# EAGLE design usbtin_clone (EAGLE 6.5.0)
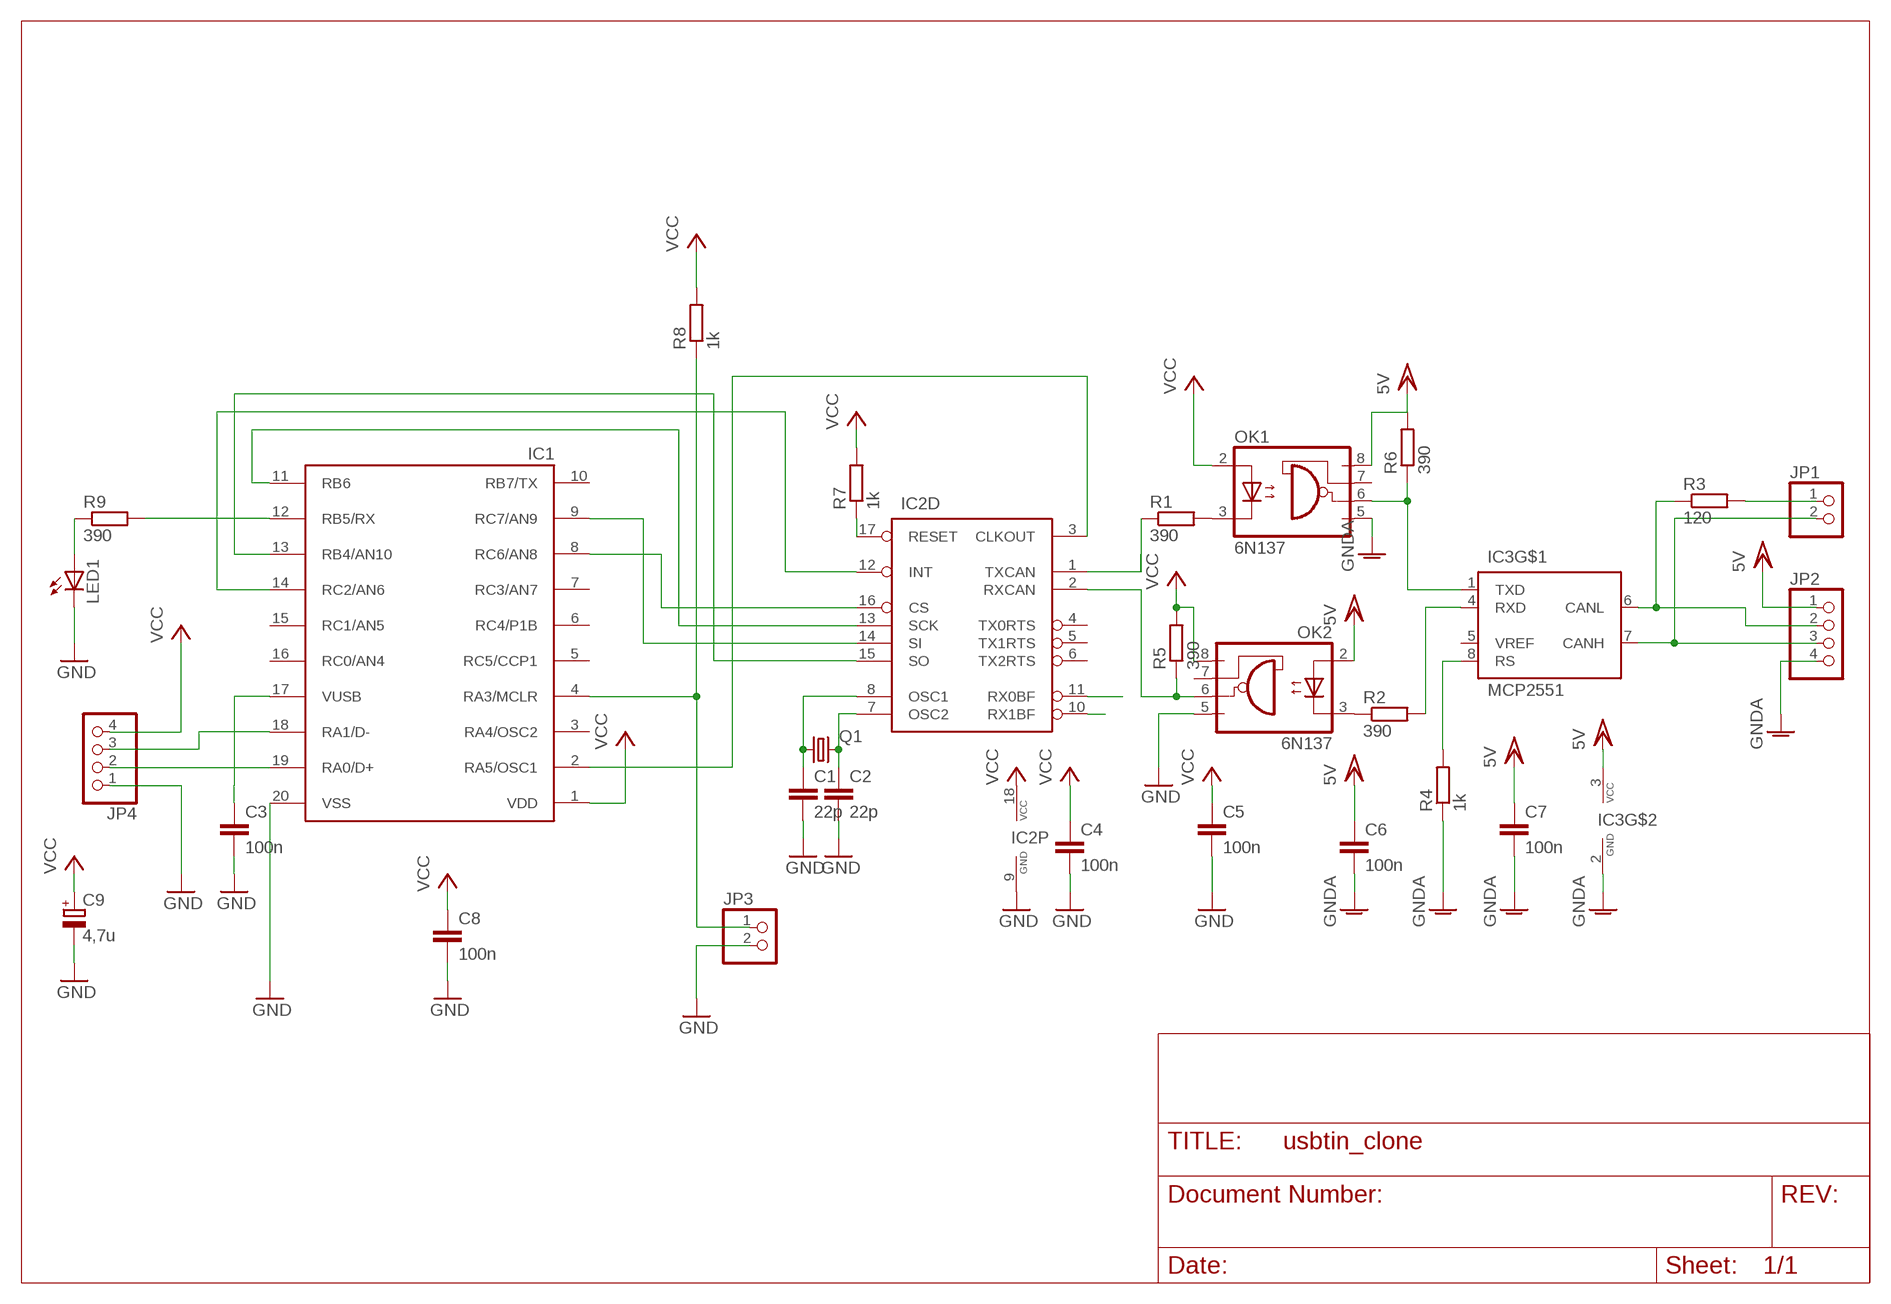
[diagram p0: schematic, sheet 1]

## Parts
C1  22p  C-EU025-025X050  [C025-025X050]
C2  22p  C-EU025-025X050  [C025-025X050]
C3  100n  C-EU025-025X050  [C025-025X050]
C4  100n  C-EU025-025X050  [C025-025X050]
C5  100n  C-EU025-025X050  [C025-025X050]
C6  100n  C-EU025-025X050  [C025-025X050]
C7  100n  C-EU025-025X050  [C025-025X050]
C8  100n  C-EU025-025X050  [C025-025X050]
C9  4,7u  CPOL-EUE2.5-5  [E2,5-5]
IC1  18F14K50  PIC18F14K50  [DIL20]
IC2  MCP2515P  [DIL18]
IC3  MCP2551  MCP2551DIL8  [DIL08]
JP1  PINHD-1X2  [1X02]
JP2  PINHD-1X4  [1X04]
JP3  PINHD-1X2  [1X02]
JP4  PINHD-1X4  [1X04]
LED1  LED3MM  [LED3MM]
OK1  6N137  [DIL08]
OK2  6N137  [DIL08]
Q1  CRYSTALHC49S  [HC49/S]
R1  390  R-EU_0204/7  [0204/7]
R2  390  R-EU_0204/7  [0204/7]
R3  120  R-EU_0204/7  [0204/7]
R4  1k  R-EU_0204/7  [0204/7]
R5  390  R-EU_0204/7  [0204/7]
R6  390  R-EU_0204/7  [0204/7]
R7  1k  R-EU_0204/7  [0204/7]
R8  1k  R-EU_0204/7  [0204/7]
R9  390  R-EU_0204/7  [0204/7]

## Nets
GND: C1.2 C2.2 C3.2 C4.2 C5.2 C8.2 C9.- IC1.20(VSS) IC2.9(P:GND) JP3.2 JP4.1 LED1.K(C) OK2.5(GND)
GNDA: C6.2 C7.2 IC3.2(GND) JP2.4 OK1.5(GND) R4.1
N$1: C1.1 IC2.8(D:OSC1) Q1.1
N$2: C2.1 IC2.7(D:OSC2) Q1.2
N$3: OK1.3(C) R1.2
N$4: IC2.2(D:RXCAN) OK2.6(VO) R5.1
N$5: IC2.1(D:TXCAN) R1.1
N$6: IC3.1(TXD) OK1.6(VO) R6.1
N$7: OK2.3(C) R2.1
N$8: IC3.4(RXD) R2.2
N$9: IC3.6(CANL) JP2.2 R3.1
N$10: JP1.1 R3.2
N$11: IC3.7(CANH) JP1.2 JP2.3
N$12: IC3.8(RS) R4.2
N$13: C3.1 IC1.17(VUSB)
N$14: IC2.17(D:RESET) R7.1
N$15: IC1.2(RA5/OSC1) IC2.3(D:CLKOUT)
N$16: IC1.14(RC2/AN6) IC2.12(D:INT)
N$17: IC1.4(RA3/MCLR) JP3.1 R8.1
N$18: IC1.19(RA0/D+) JP4.2
N$19: IC1.18(RA1/D-) JP4.3
N$20: IC1.12(RB5/RX) R9.2
N$21: LED1.A R9.1
N$22: IC2.11(D:RX0BF)
N$24: IC1.8(RC6/AN8) IC2.16(D:CS)
N$25: IC1.11(RB6) IC2.13(D:SCK)
N$26: IC1.9(RC7/AN9) IC2.14(D:SI)
N$27: IC1.13(RB4/AN10) IC2.15(D:SO)
N$28: IC2.10(D:RX1BF)
VCC: C4.1 C5.1 C8.1 C9.+ IC1.1(VDD) IC2.18(P:VCC) JP4.4 OK1.2(A) OK2.8(VCC) R5.2 R7.2 R8.2
VCC/2: C6.1 C7.1 IC3.3(VCC) JP2.1 OK1.8(VCC) OK2.2(A) R6.2 ; supply symbol labelled 5V
Unconnected: IC1.3(RA4/OSC2) IC1.5(RC5/CCP1) IC1.6(RC4/P1B) IC1.7(RC3/AN7) IC1.10(RB7/TX) IC1.15(RC1/AN5) IC1.16(RC0/AN4) IC2.4(D:TX0RTS) IC2.5(D:TX1RTS) IC2.6(D:TX2RTS) IC3.5(VREF) OK1.7(VE) OK2.7(VE)

## Library data of the parts
C1-C8 = resistor:C-EU: CAPACITOR, European symbol
C9 = resistor:CPOL-EU: POLARIZED CAPACITOR, European symbol
IC1 = pic18f14k50:PIC18F14K50
IC2 = can:MCP2515: MC2515 Stand-Alone CAN Controller With SPI Interface, Microchip
IC3 = can:MCP2551: CAN Tranceiver Microchip
JP1 JP3 = pinhead:PINHD-1X2: PIN HEADER
JP2 JP4 = pinhead:PINHD-1X4: PIN HEADER
LED1 = adafruit:LED: LED OSRAM: - CHIPLED LG R971, LG N971, LY N971, LG Q971, LY Q971, LO R971, LY R971 LH N974, LH R974 LS Q976, LO Q976, LY Q976 LO Q996 - Hyper CHIPLED LW Q18S LB Q993, LB Q99A, LB R99A - SideLED LS A670, LO A670, LY A670, LG A670, LP A670 LB A673, LV A673, LT A673, LW A673 LH A674 LY A675 LS A676, LA A676, LO A676, LY A676, LW A676 LS A679, LY A679, LG A679 - Hyper Micro SIDELED® LS Y876, LA Y876, LO Y876, LY Y876 LT Y87S - SmartLED LW L88C, LW L88S LB L89C, LB L89S, LG L890 LS L89K, LO L89K, LY L89K LS L896, LA L896, LO L896, LY L896 - TOPLED LS T670, LO T670, LY T670, LG T670, LP T670 LSG T670, LSP T670, LSY T670, LOP T670, LYG T670 LG T671, LOG T671, LSG T671 LB T673, LV T673, LT T673, LW T673 LH T674 LS T676, LA T676, LO T676, LY T676, LB T676, LH T676, LSB T676, LW T676 LB T67C, LV T67C, LT T67C, LS T67K, LO T67K, LY T67K, LW E67C LS E67B, LA E67B, LO E67B, LY E67B, LB E67C, LV E67C, LT E67C LW T67C LS T679, LY T679, LG T679 LS T770, LO T770, LY T770, LG T770, LP T770 LB T773, LV T773, LT T773, LW T773 LH T774 LS E675, LA E675, LY E675, LS T675 LS T776, LA T776, LO T776, LY T776, LB T776 LHGB T686 LT T68C, LB T68C - Hyper Mini TOPLED® LB M676 - Mini TOPLED Santana® LG M470 LS M47K, LO M47K, LY M47K Source: http://www.osram.convergy.de/
OK1 OK2 = optocoupler:6N137: MOTOROLA OPTO COUPLER; MPN: 6N137; OC_FARNELL: 1328376; OC_NEWARK: 52M1895
Q1 = crystal:CRYSTAL: CRYSTAL; OC_FARNELL: 1667008; OC_NEWARK: unknown
R1-R9 = resistor:R-EU_: RESISTOR, European symbol

## Board
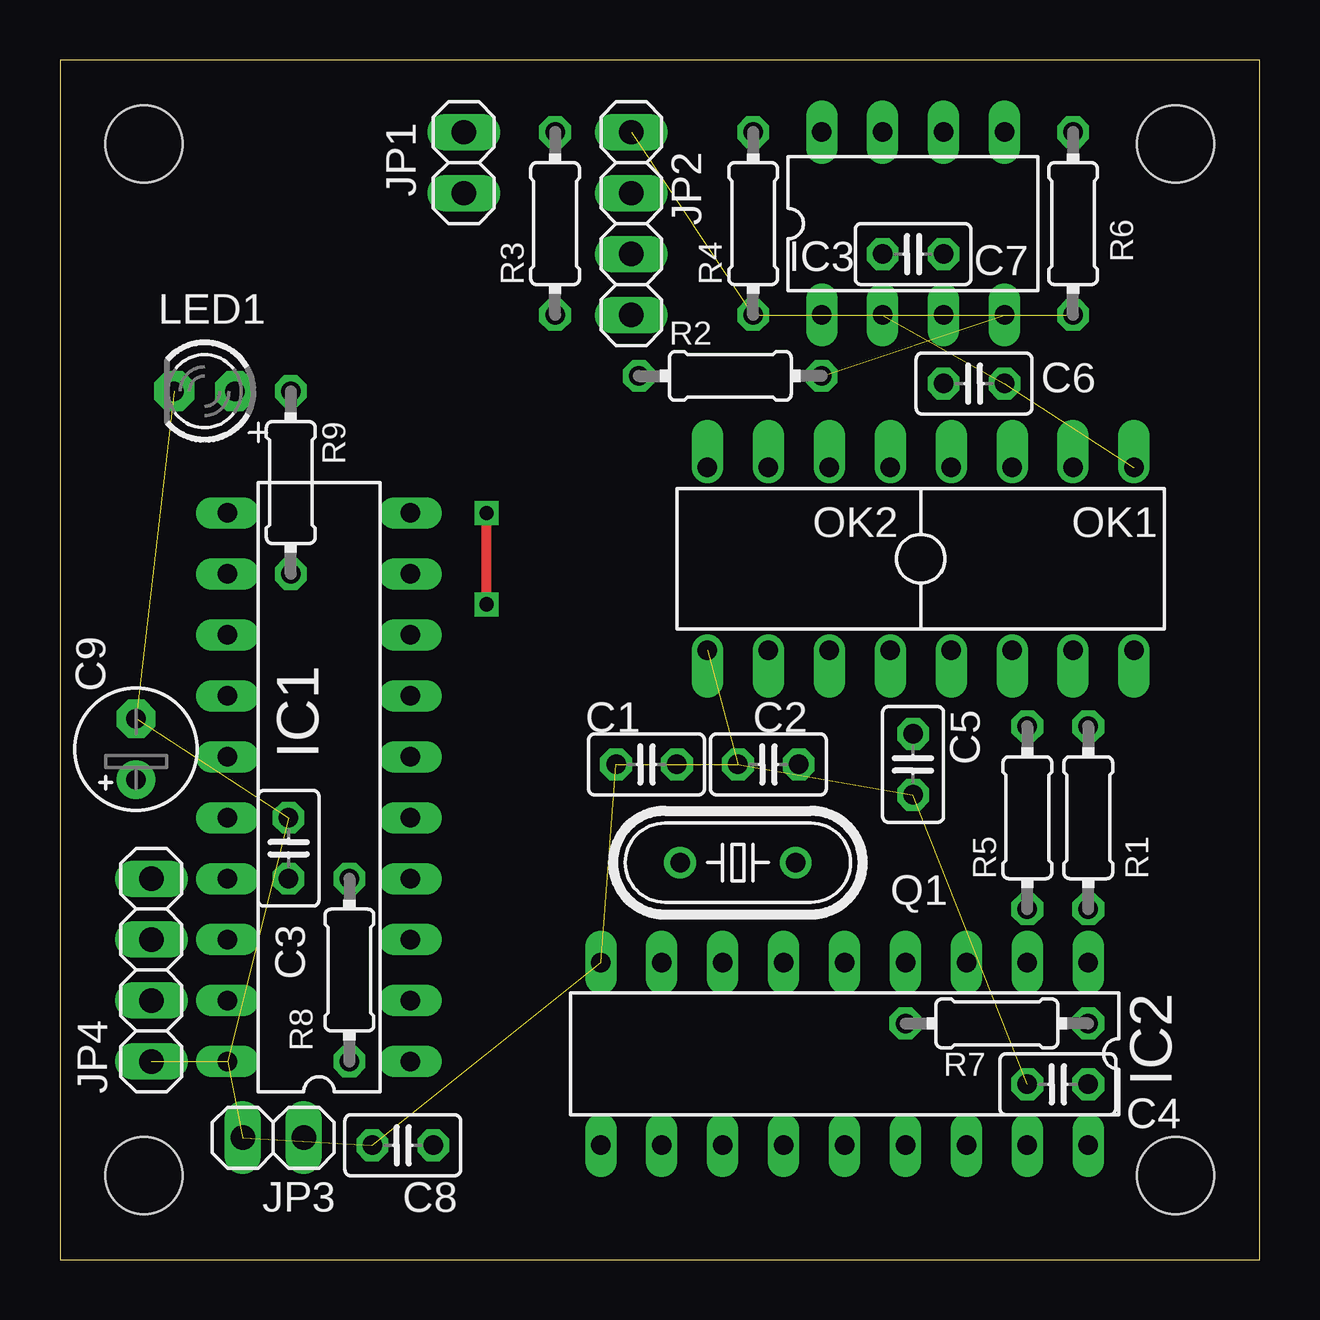
[diagram p1: board, top side]
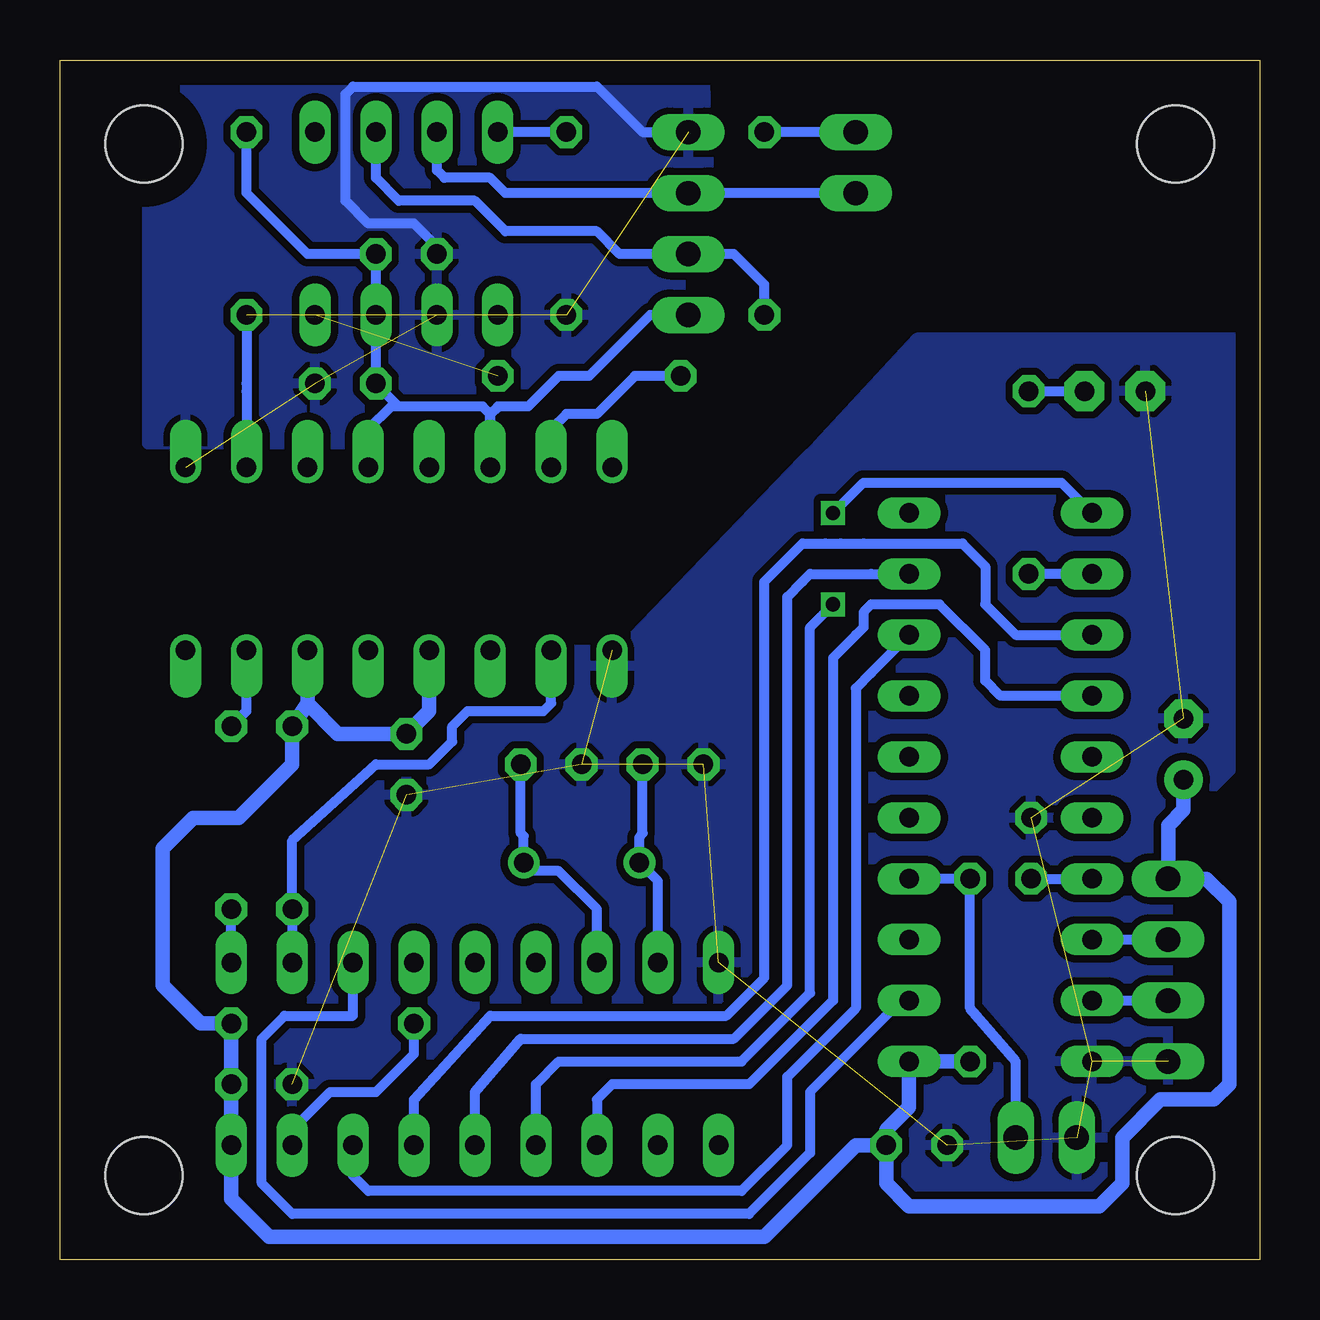
[diagram p2: board, bottom side, seen from below]

Size 50 x 50 mm. Coordinates in mm from the lower left corner, seen from the top.
Outline: 0,0 50,0 50,50 0,50 0,0
Copper layers (1*16): Top 0.035mm / dielectric 1.5mm / Bottom 0.035mm
Design rules "default": minimum track width 10mil, minimum drill 24mil, track to track 8mil, track to pad 8mil, pad to pad 8mil, via to via 8mil, smd to smd 8mil, copper to edge 40mil, drill to drill 8mil, minimum pad ring 10mil, minimum via ring 8mil, stop-mask expansion 4mil, vias tented up to drill 0mil, thermal gap 10mil
Holes 3.2 mm at 3.5,46.5 3.5,3.5 46.5,3.5 46.5,46.5

### Footprints (pad centres in the part's own frame; a part is rotated, then mirrored left to right if it is on the bottom)
C025-025X050 = drill 0.813 octagon: 1 -1.27,0; 2 1.27,0
E2,5-5 = drill 0.813 pad 1.6: + -1.27,0 | drill 0.813 pad 1.6 octagon: - 1.27,0
DIL20 = drill 0.813 long: 1 -11.43,-3.81; 2 -8.89,-3.81; 3 -6.35,-3.81; 4 -3.81,-3.81; 5 -1.27,-3.81; 6 1.27,-3.81; 7 3.81,-3.81; 8 6.35,-3.81; 9 8.89,-3.81; 10 11.43,-3.81; 11 11.43,3.81; 12 8.89,3.81; 13 6.35,3.81; 14 3.81,3.81; 15 1.27,3.81; 16 -1.27,3.81; 17 -3.81,3.81; 18 -6.35,3.81; 19 -8.89,3.81; 20 -11.43,3.81
DIL18 = drill 0.813 long: 1 -10.16,-3.81; 2 -7.62,-3.81; 3 -5.08,-3.81; 4 -2.54,-3.81; 5 0,-3.81; 6 2.54,-3.81; 7 5.08,-3.81; 8 7.62,-3.81; 9 10.16,-3.81; 10 10.16,3.81; 11 7.62,3.81; 12 5.08,3.81; 13 2.54,3.81; 14 0,3.81; 15 -2.54,3.81; 16 -5.08,3.81; 17 -7.62,3.81; 18 -10.16,3.81
DIL08 = drill 0.813 long: 1 -3.81,-3.81; 2 -1.27,-3.81; 3 1.27,-3.81; 4 3.81,-3.81; 5 3.81,3.81; 6 1.27,3.81; 7 -1.27,3.81; 8 -3.81,3.81
1X02 = drill 1.016 long: 1 -1.27,0; 2 1.27,0
1X04 = drill 1.016 long: 1 -3.81,0; 2 -1.27,0; 3 1.27,0; 4 3.81,0
LED3MM = drill 0.813 pad 1.676 octagon: A -1.27,0; K 1.27,0
DIL08' = drill 0.813 offset: 1 -3.81,-3.81; 2 -1.27,-3.81; 3 1.27,-3.81; 4 3.81,-3.81; 5 3.81,3.81; 6 1.27,3.81; 7 -1.27,3.81; 8 -3.81,3.81
HC49/S = drill 0.813: 1 -2.413,0; 2 2.413,0
0204/7 = drill 0.813 octagon: 1 -3.81,0; 2 3.81,0

### Placement (x,y rotation side)
C1  24.45,20.64 180 top
C2  29.53,20.64 180 top
C3  9.53,17.14 90 top
C4  41.59,7.3 180 top
C5  35.56,20.64 270 top
C6  38.1,36.51 0 top
C7  35.56,41.91 180 top
C8  14.29,4.76 180 top
C9  3.17,21.27 90 top
IC1  10.79,19.68 90 top
IC2  32.7,8.57 180 top
IC3  35.56,43.18 0 top
JP1  16.83,45.72 270 top
JP2  23.81,43.18 90 top
JP3  8.89,5.08 180 top
JP4  3.81,12.06 90 top
LED1  6.03,36.2 180 top
OK1  6N137  [DIL08']  40.96,29.21 0 top
OK2  6N137  [DIL08']  30.8,29.21 180 top
Q1  28.26,16.54 0 top
R1  42.86,18.41 90 top
R2  27.94,36.83 0 top
R3  20.64,43.18 90 top
R4  28.89,43.18 90 top
R5  40.32,18.41 90 top
R6  42.23,43.18 90 top
R7  39.05,9.84 0 top
R8  12.06,12.06 270 top
R9  9.62,32.38 270 top

### Tracks (layer width: path | path; a pad name or v marks a point on that pad's centre or on a via)
GND  (12 unrouted)
  pour Bottom (isolate 0.305): 0,0 3.81,3.81 3.81,17.78 0.95,20.64 0,20.64 0,38.42 14.29,38.42 18.41,33.97 19.05,33.34 26.67,25.4 48.58,25.4 48.58,0
GNDA  (4 unrouted)
  Bottom 0.406: C7.2 34.29,42.23 35.24,43.18 37.15,43.18 38.1,44.13 38.1,48.58 37.78,48.9 27.62,48.9 25.72,46.99 JP2.4
  pour Bottom (isolate 0.305): 23.18,50.16 22.86,43.81 23.5,40.96 24.13,40.64 24.13,35.24 26.04,33.97 46.35,33.97 46.35,50.16
N$1
  Bottom 0.406: IC2.8 25.08,15.78 Q1.1 25.84,17.59 25.72,17.78 C1.1
N$2
  Bottom 0.406: IC2.7 27.62,14.61 29.21,16.19 30.64,16.19 Q1.2 30.67,17.65 30.8,17.78 C2.1
N$3
  Bottom 0.406: R1.2 42.55,22.54 42.23,22.86 OK1.3
N$4
  Bottom 0.406: IC2.2 R5.1 40.32,17.46 36.83,20.64 34.61,20.64 33.66,21.59 33.66,22.23 33.02,22.86 29.84,22.86 29.53,23.18 OK2.6
N$5
  Bottom 0.406: IC2.1 R1.1
N$6  (1 unrouted)
  Bottom 0.406: R6.1 42.23,36.51 42.23,36.2 OK1.6
N$7
  Bottom 0.406: R2.1 26.04,36.83 27.62,35.24 28.89,35.24 29.53,34.61 OK2.3
N$8  (1 unrouted)
N$9
  Bottom 0.406: IC3.6 36.83,45.09 35.88,44.13 32.7,44.13 31.43,42.86 27.62,42.86 26.67,41.91 JP2.2 21.91,41.91 20.64,40.64 R3.1
N$10
  Bottom 0.406: JP1.1 R3.2
N$11
  Bottom 0.406: IC3.7 34.29,45.4 33.97,45.09 32.07,45.09 31.43,44.45 JP2.3 JP1.2
N$12
  Bottom 0.406: R4.2 IC3.8
N$13
  Bottom 0.406: C3.1 IC1.17
N$14
  Bottom 0.406: IC2.17 40.32,5.4 38.73,6.99 36.83,6.99 35.24,8.57 R7.1
N$15
  Bottom 0.406: IC1.2 14.92,10.79 18.73,6.99 18.73,4.45 21.27,1.91 40.32,1.91 41.59,3.17 41.59,9.21 40.64,10.16 37.78,10.16 IC2.3
N$16
  Bottom 0.406: IC1.14 10.79,23.5 11.43,24.13 11.43,25.4 13.34,27.3 16.19,27.3 16.51,26.99 16.51,26.35 16.83,26.04 17.78,25.08 17.78,24.13 17.78,10.79 21.27,7.3 26.99,7.3 27.62,6.67 IC2.12
N$17
  Bottom 0.406: IC1.4 R8.1 12.06,10.48 10.16,8.26 JP3.1
N$18
  Bottom 0.406: IC1.19 JP4.2
N$19
  Bottom 0.406: IC1.18 JP4.3
N$20
  Bottom 0.406: IC1.12 R9.2
N$21
  Bottom 0.406: R9.1 LED1.A
N$24
  Bottom 0.406: IC1.8 16.19,24.45 16.83,23.81 16.83,10.48 19.68,7.62 19.68,4.76 21.59,2.86 37.15,2.86 37.78,3.49 IC2.16
N$25  (via drill 0.6)
  Top 0.406: v17.78,27.3 v17.78,31.11
  Bottom 0.406: IC2.13 30.16,7.3 29.21,8.26 21.59,8.26 18.73,11.11 18.73,26.35 v17.78,27.3 | IC1.11 8.26,32.38 10.16,32.38 16.51,32.38 v17.78,31.11
N$26
  Bottom 0.406: IC2.14 32.7,6.99 30.8,9.21 21.91,9.21 19.68,11.43 19.68,25.08 19.68,26.35 19.68,27.62 19.05,28.26 18.73,28.57 16.19,28.57 IC1.9
N$27
  Bottom 0.406: IC2.15 35.24,6.67 32.07,10.16 22.23,10.16 20.64,11.75 20.64,24.77 20.64,28.26 19.05,29.84 18.1,29.84 17.46,29.84 16.51,29.84 12.38,29.84 11.43,28.89 11.43,27.3 10.16,26.04 IC1.13
VCC
  Bottom 0.61: 39.69,23.18 R5.2 40.32,20.64 42.55,18.41 44.45,18.41 45.72,17.14 45.72,11.43 44.13,9.84 R7.2 C4.1 IC2.18 42.86,2.54 41.27,0.95 20.64,0.95 16.83,4.76 C8.1 | 39.69,23.18 OK1.2 | 39.69,23.18 38.42,21.91 C5.1 34.61,22.86 OK2.8 | C8.1 15.56,5.4 14.61,6.35 IC1.1 R8.2 | C9.+ 3.17,18.73 3.81,18.1 JP4.4 2.22,15.88 1.27,14.92 1.27,7.3 1.91,6.67 4.13,6.67 5.71,5.08 5.71,3.17 6.67,2.22 14.61,2.22 15.56,3.17 C8.1
VCC/2
  Bottom 0.406: JP2.1 25.4,39.37 27.94,36.83 29.21,36.83 30.48,35.56 31.75,35.56 32.07,35.24 | 32.07,35.24 OK2.2 32.07,35.24 | 32.07,35.24 32.38,35.56 35.88,35.56 | 35.88,35.56 C6.1 IC3.3 C7.1 39.69,41.91 42.23,44.45 R6.2 | 35.88,35.56 36.2,35.56 37.15,34.61 OK1.8